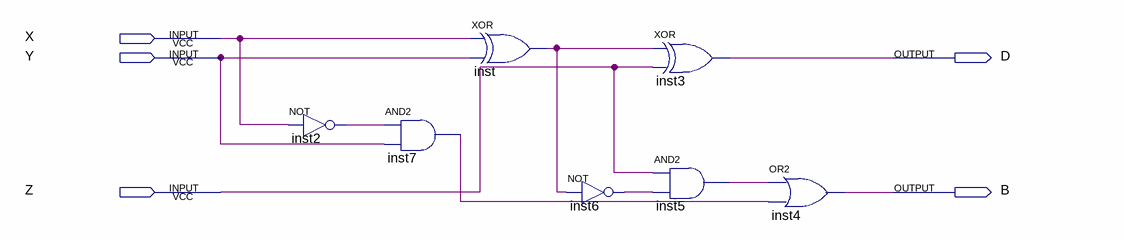
[diagram p0: schematic sheet]
// Quartus schematic fullSubtracter.bdf as structural Verilog: 7 symbols, 5 pins
module fullSubtracter (
  input  X,
  input  Y,
  input  Z,
  output D,
  output B
);

  wire inst2_out, inst5_out, inst6_out, inst7_out, inst_out;

  not inst2 (inst2_out, X);
  and inst7 (inst7_out, inst2_out, Y);
  xor inst (inst_out, X, Y);
  not inst6 (inst6_out, inst_out);
  xor inst3 (D, inst_out, Z);
  and inst5 (inst5_out, Z, inst6_out);
  or inst4 (B, inst5_out, inst7_out);
endmodule
